# Altium schematic sheet S7CAS-PLEIADES-CARTE-MERE_P20_Arbre-alimentation.SchDoc
size Tabloid; Sheet_Name: Power Tree; Size: 11x17
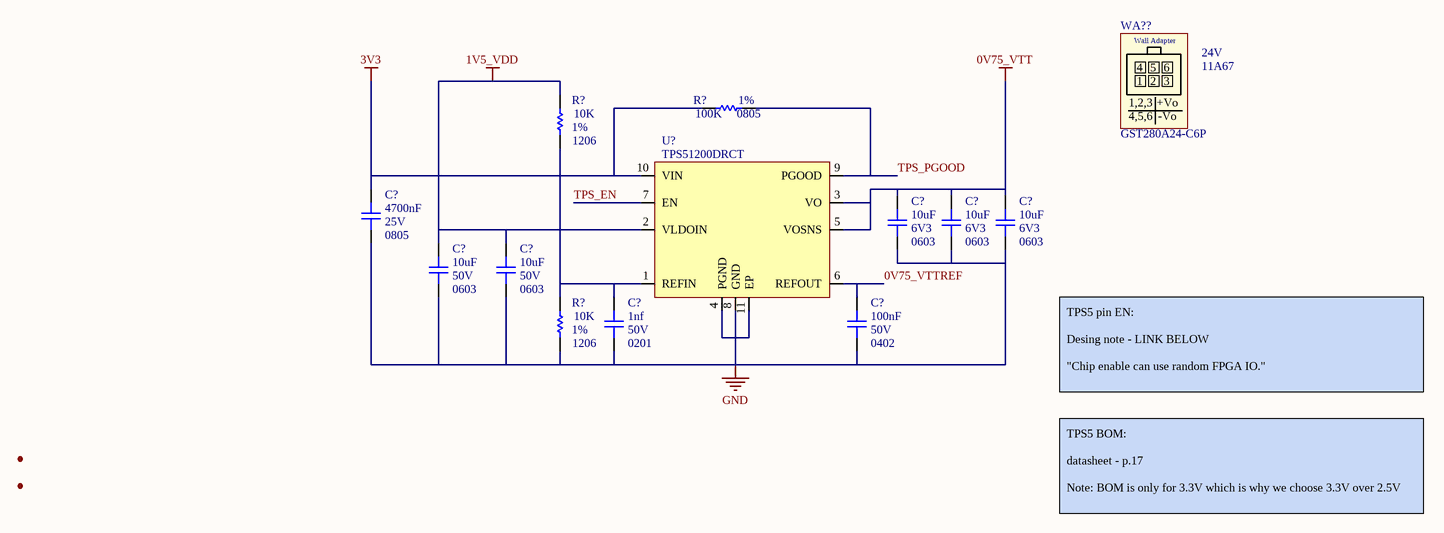
[diagram p0: S7CAS-PLEIADES-CARTE-MERE_P20_Arbre-alimentation.SchDoc]

## Parts
(Parts that share a designator on the sheet are numbered #1, #2 ... from top to bottom, then left to right.)
C?#1  value 4700nF  Voltage: 25V  Package: 0805  [CAP_0402]  (hidden comment: CAP - 0402)
C?#2  value 10uF  Voltage: 6V3  Package: 0603  [CAP_0603]  (hidden comment: CAP - 0603)
C?#3  value 10uF  Voltage: 6V3  Package: 0603  [CAP_0603]  (hidden comment: CAP - 0603)
C?#4  value 10uF  Voltage: 6V3  Package: 0603  [CAP_0603]  (hidden comment: CAP - 0603)
C?#5  value 10uF  Voltage: 50V  Package: 0603  [CAP_0603]  (hidden comment: CAP - 0603)
C?#6  value 10uF  Voltage: 50V  Package: 0603  [CAP_0603]  (hidden comment: CAP - 0603)
C?#7  value 1nf  Voltage: 50V  Package: 0201  [CAP_0201]  (hidden comment: CAP - 0201)
C?#8  value 100nF  Voltage: 50V  Package: 0402  [CAP_0201]  (hidden comment: CAP - 0201)
R?#1  value 100K  Package: 0805  Precision: 1%  [RES_0402]  (hidden comment: RES - 0402)
R?#2  value 10K  Package: 1206  Precision: 1%  [RES_0402]  (hidden comment: RES - 0402)
R?#3  value 10K  Package: 1206  Precision: 1%  [RES_0402]  (hidden comment: RES - 0402)
U?  TPS51200DRCT  [REG_PMIC_TPS51200DRCT]
WA??  GST280A24-C6P  value 24V  Current Rating: 11A67  [Model Name]  (mechanical)

## Nets
0V75_VTT: C?#2.2 C?#3.2 C?#4.2 U?.3(VO) U?.5(VOSNS)
1V5_VDD: C?#5.2 C?#6.2 R?#2.2 U?.2(VLDOIN)
3V3: C?#1.2 R?#1.2 U?.10(VIN)
GND: C?#1.1 C?#2.1 C?#3.1 C?#4.1 C?#5.1 C?#6.1 C?#7.1 C?#8.1 R?#3.1 U?.4(PGND) U?.8(GND) U?.11(EP)
0V75_VTTREF: C?#8.2 U?.6(REFOUT)
TPS_EN: U?.7(EN)
TPS_PGOOD: R?#1.1 U?.9(PGOOD)
NetC?#7_2: C?#7.2 R?#2.1 R?#3.2 U?.1(REFIN)

## Notes on the sheet
- TPS5 pin EN:
  Desing note - LINK BELOW
  "Chip enable can use random FPGA IO."
  https://e2e.ti.com/support/power-management-group/power-management/f/power-management-forum/981448/tps51200-about-slp_s3-in-ddr3-application
- TPS5 BOM:
  datasheet - p.17
  Note: BOM is only for 3.3V which is why we choose 3.3V over 2.5V
- Sheet Name
- Project Title
- Global Project
- Size
- Group
- Revision
- Date
- Sheet
- of
- Filename
- Designers
- (in symbol UND_GST280A24-C6P) Wall Adapter; 4; 5; 6; 1; 2; 3; 1,2,3; +Vo; 4,5,6; -Vo

## Library data of the parts
C?#1 = CAP - 0402: Mfg Part Number: GRM219R61E475KA73; Precision: 10%; Current: *; CreatedBy: Jonathan Bouchard; Power: *
C?#2-C?#6 = CAP - 0603: Mfg Part Number: GRM188B30J106ME47; Precision: 10%; Current: *; CreatedBy: Jonathan Bouchard; Power: *
C?#7 = CAP - 0201: Mfg Part Number: GRM0335C1H102JE01; Precision: 10%; Current: *; CreatedBy: Jonathan Bouchard; Power: *
C?#8 = CAP - 0201: Mfg Part Number: GRM155R60J104KA01; Precision: 10%; Current: *; CreatedBy: Jonathan Bouchard; Power: *
R?#1 = RES - 0402: Mfg Part Number: CRM0805-FX-1003ELF; Voltage: 50V; Power: 1/4W; Current: *; CreatedBy: Jonathan Bouchard
R?#2 R?#3 = RES - 0402: Mfg Part Number: CRM1206-FX-1002ELF; Voltage: 50V; Power: 1/16W; Current: *; CreatedBy: Jonathan Bouchard
U? = REG_PMIC_TPS51200DRCT: REG - DDR TERMINATION/REF REG - 10-VFDFN; Manufacturer #1: Texas Instruments; Value: DDR, DDR2, DDR3(L), DDR4; Voltage Rating: 2.375V ~ 3.5V; Current Rating: Source: 3A~4.5A, Sink: 3.5A~5.5A; GRAMS Lib Spec: 2.8; Magnetic Material: Unknown; Polarized: Yes; Tolerance: *; Power Max: *; HelpURL: http://www.ti.com/lit/ds/symlink/tps51200.pdf; CreatedBy/Date: Joel Lemay 2019-03-19; VerifiedBy: Nicolas V. (2019-05-31); Temperature: -40°C ~ 85°C; Package: 10-VFDFN; Manufacturer #2: *; Note: *; Assembly Type: SMD; Part Number #2: *; Part Number #1: TPS51200DRCT; Supplier 1: Digi-Key; Supplier Part Number 1: 296-23830-1-ND; Cryo: UNKNOWN
WA?? = UND_GST280A24-C6P: UND - AC/DC DESKTOP ADAPTER 24V 280W - MEC; Manufacturer #1: MEAN WELL USA Inc.; Tolerance: ±3%; Voltage Rating: 85~264VAC; GRAMS Lib Spec: 2.8; Magnetic Material: Unknown; Polarized: Yes; Power Max: 280W; HelpURL: https://www.meanwell.com/Upload/PDF/GST280A/GST280A-SPEC.PDF; CreatedBy/Date: Caroline Paulin - 5 avril 2019; VerifiedBy: Nicolas V. (2019-07-05); Temperature: -30°C to +70°C; Package: -; Manufacturer #2: *; Note: *; Assembly Type: -; Part Number #2: *; Part Number #1: GST280A24-C6P; Supplier 1: Digi-Key; Supplier Part Number 1: 1866-2122-ND; Cryo: UNKNOWN